# EasyEDA Pro project ProPrj_TC375_2025-11-27.epro, board PCB2
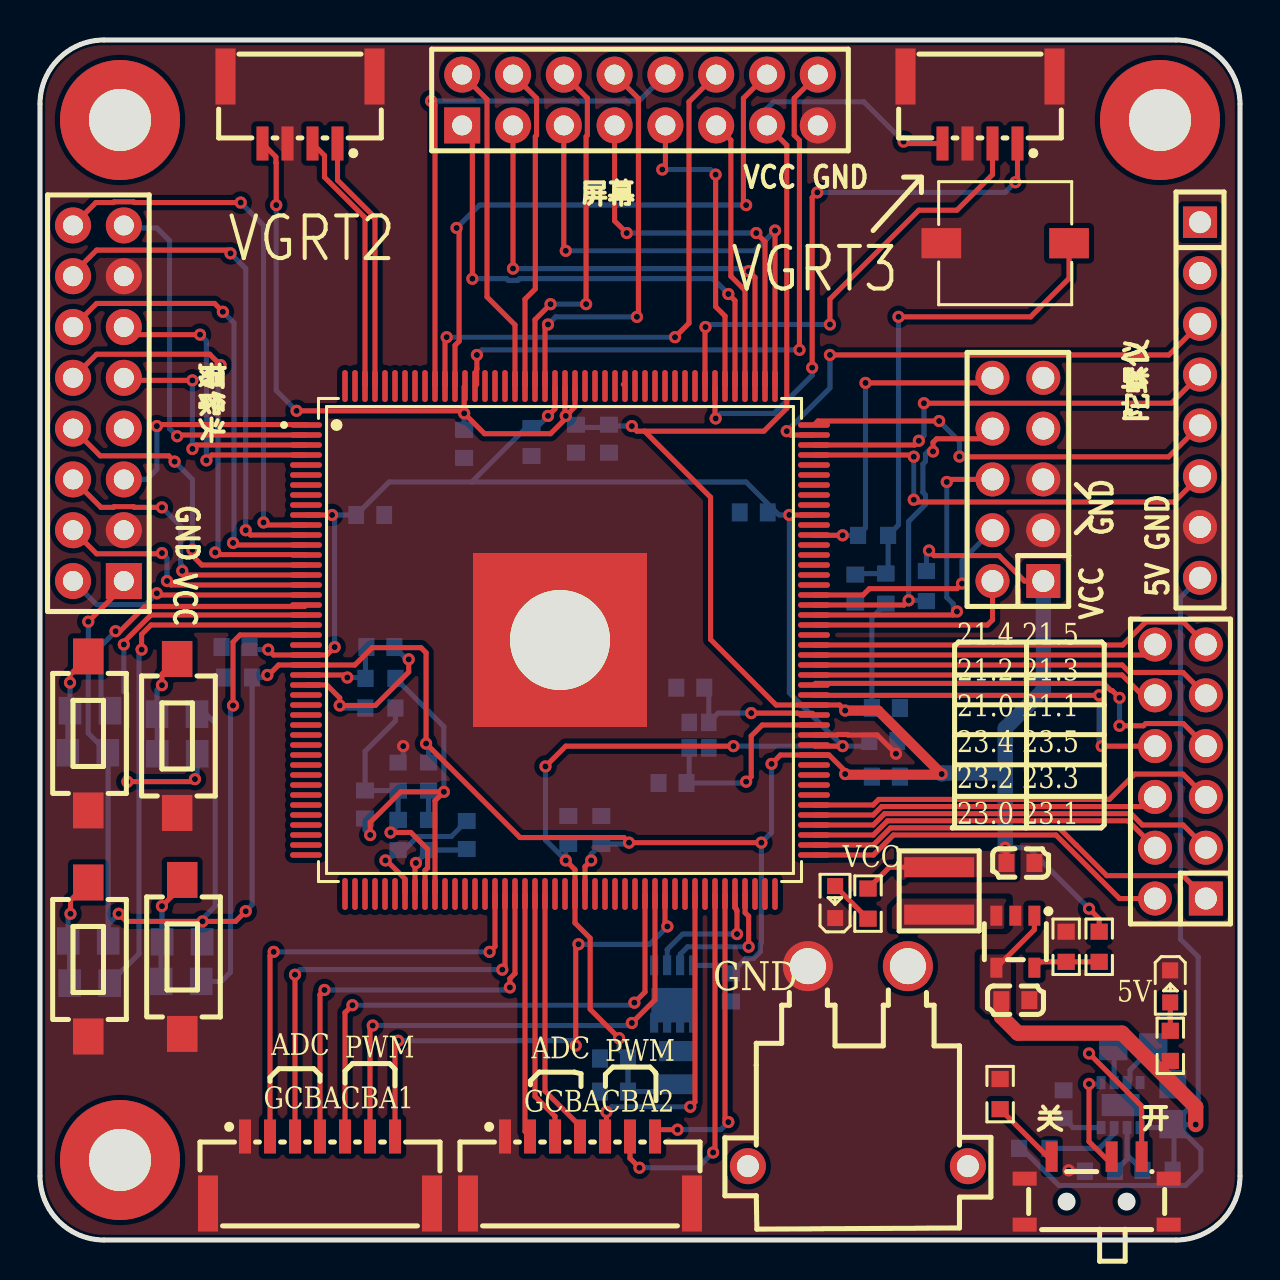
[diagram p4: board, top side]
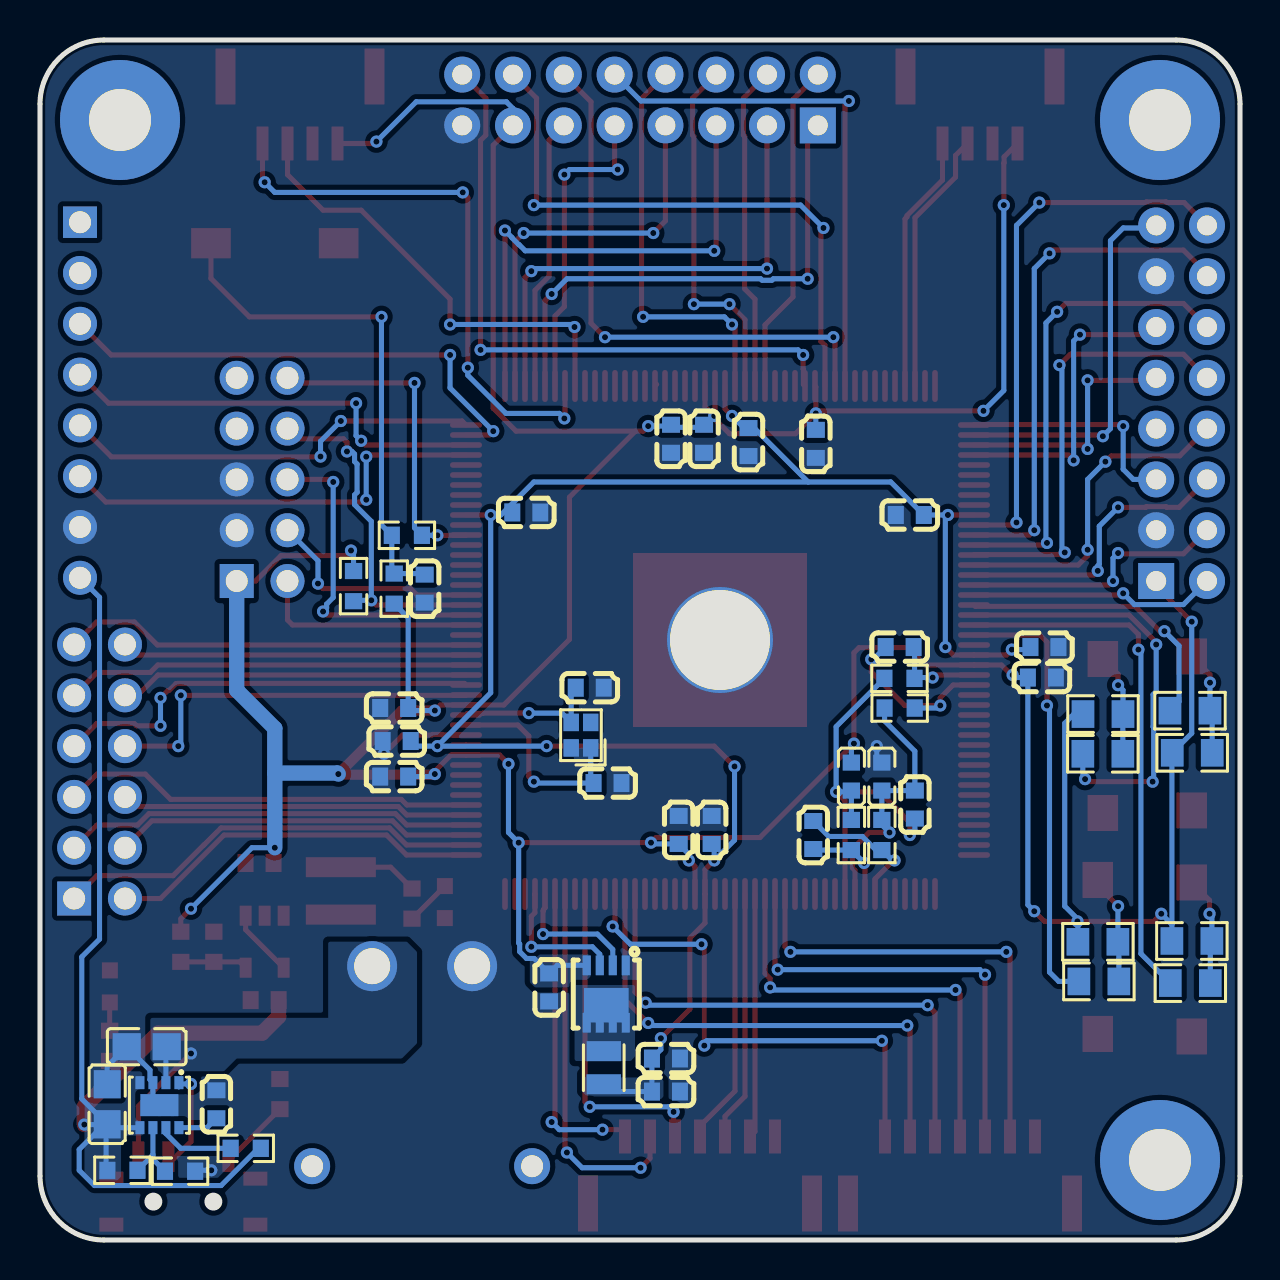
[diagram p5: board, bottom side, seen from below]

Outline 60 x 60 mm; copper layers: Top Layer, Bottom Layer. Coordinates in mm from the lower left corner of the outline.
Outline path: 0,56.8 0,3.2 arc(0.94,0.94) 3.2,0 56.8,0 arc(59.06,0.94) 60,3.2 60,56.8 arc(59.06,59.06) 56.8,60 3.2,60 arc(0.94,59.06) 0,56.8
Stack: Top Layer 0.035mm / Dielectric1 1.51mm FR4 er 4.5 / Bottom Layer 0.035mm

## Design rules (mm)
template: 自定义配置
spacing copperThickness1oz (default): track to track 0.102, other pairs 0.152 to 0.3
spacing copperThickness2oz: track to track 0.203, other pairs 0.152 to 0.3
track width copperThickness1oz (default): min 0.127, default 0.254, max 2.54
track width copperThickness2oz: min 0.203, default 0.254, max 2.54
differential pair differentialPair (default): width min 0.127, default 0.254, max 2.54; gap min 0.152, default 0.152
via viaSize (default): diameter min 0.5, default 0.61, max 10; hole min 0.3, default 0.305, max 6.3

## Placement (name value [footprint] x y rotation side)
C1  100nF  [C0603]  16.51 36.25 180 bottom
C2  100nF  [C0603]  9.78 29.65 0 bottom
C3  100nF  [C0603]  9.91 28.12 0 bottom
C4  100nF  [C0603]  28.07 20.5 270 bottom
C5  22uF  [C0603]  34.54 12.63 270 bottom
C6  10uF  [C0603]  28.7 7.42 0 bottom
C7  22uF  [C0603]  28.7 9.07 0 bottom
C8  100nF  [C0603]  21.21 39.81 90 bottom
C9  100nF  [C0603]  24.57 39.9 90 bottom
C10  100nF  [C0603]  28.45 40.06 90 bottom
C11  100nF  [C0603]  26.8 40.06 90 bottom
C12  100nF  [C0603]  26.42 20.5 270 bottom
C13  100nF  [C0603]  35.69 36.38 0 bottom
C14  100nF  [C0603]  42.29 26.6 180 bottom
C15  100nF  [C0603]  42.16 24.95 180 bottom
C16  100nF  [C0603]  42.29 23.17 180 bottom
C17  100nF  [C0603]  16.26 21.77 90 bottom
C18  100nF  [C0603]  21.34 20.25 90 bottom
C19  100nF  [C0603]  17.02 29.65 0 bottom
C20  100nF  [C0603]  40.77 32.57 90 bottom
C21  100nF  [C0603]  31.62 22.85 180 bottom
C22  100nF  [C0603]  32.51 27.61 0 bottom
C111  10uF  [C0603]  49.02 18.85 180 top
C112  4.7uF  [C0603]  48.77 11.99 180 top
C113  10uF  [C0805]  54.67 9.66 180 bottom
C114  3.3nF  [C0603]  51.18 6.79 270 bottom
C115  22uF  [C0805]  56.64 6.79 90 bottom
CN1  WAFER-GH1.25-7PLB  [CONN-SMD_7P-P1.25_XUNPU_WAFER-GH1.25-7PLB]  14 3.5 0 top
CN2  WAFER-GH1.25-7PLB  [CONN-SMD_7P-P1.25_XUNPU_WAFER-GH1.25-7PLB]  27 3.5 0 top
CN32  XT30PW-M30.G.Y  [CONN-TH_XT30PW-M]  40.89 8.69 0 top
H1  PZ254V-12-10P  [HDR-TH_10P-P2.54-V-M-R2-C5-S2.54]  48.9 38.03 90 top
H6  PZ254V-12-12P  [HDR-TH_12P-P2.54-V-M-R2-C6-S2.54]  57.02 23.42 90 top
J1  2.54-2*8P母  [HDR-TH_16P-P2.54-V-F-R2-C8-S2.54]  30 57 0 top
J2  2.54-2*8P母  [HDR-TH_16P-P2.54-V-F-R2-C8-S2.54]  2.92 41.84 90 top
L1  0R  [L0603]  19.43 23.17 270 bottom
L2  0R  [L0603]  17.91 23.17 270 bottom
L12  XFL4020-222MEC  [IND-SMD_L4.0-W4.0_XAL4030-332MEC]  44.96 17.45 270 top
LED12  -  [LED_0603]  39.75 16.95 90 top
LED13  -  [LED_0603]  56.51 12.63 270 top
NOREF  -  [Pad_e924]  26 30 0 top
Q2  BSZ15DC02KDHXTMA1  [POWERPAK-1212-8_L3.3-W3.3-P0.65-BL-EP]  31.69 12.3 0 bottom
R1  0R  [R0603]  17.03 28.08 0 bottom
R2  0R  [R0603]  17.02 26.6 0 bottom
R3  0R  [R0603]  17.91 20.25 270 bottom
R4  0R  [R0603]  19.43 20.25 270 bottom
R5  10K  [R0603]  44.32 32.69 90 bottom
R6  680R  [R0603]  41.66 35.23 0 bottom
R13  10K  [R0603]  42.29 32.57 270 bottom
R41  5kΩ  [R0805]  2.39 24.36 180 bottom
R42  5kΩ  [R0805]  6.85 26.3 180 bottom
R43  5kΩ  [R0805]  2.41 14.95 180 bottom
R44  5kΩ  [R0805]  7.1 14.91 180 bottom
R45  470Ω  [R0805]  2.5 26.47 0 bottom
R46  470Ω  [R0805]  6.86 24.31 0 bottom
R47  470Ω  [R0805]  2.48 12.84 0 bottom
R48  470Ω  [R0805]  7.06 12.93 0 bottom
R82  10K  [R0603]  52.96 14.66 90 top
R83  2.21K  [R0603]  51.31 14.66 270 top
R84  10K  [R0603]  41.4 16.82 90 top
R102  100K  [R0603]  49.71 4.58 0 bottom
R103  53K  [R0603]  55.88 3.49 180 bottom
R104  10K  [R0603]  53 3.44 0 bottom
R105  10K  [R0603]  56.51 9.71 270 top
R106  10K  [R0603]  48.01 7.29 270 top
SW1  TS3625A  [KEY-SMD_L6.0-W3.5-LS8.4]  2.41 25.33 270 top
SW2  TS3625A  [KEY-SMD_L6.0-W3.5-LS8.4]  6.86 25.2 270 top
SW3  TS3625A  [KEY-SMD_L6.0-W3.5-LS8.4]  2.41 14.03 270 top
SW4  TS3625A  [KEY-SMD_L6.0-W3.5-LS8.4]  7.11 14.15 270 top
SW5  MSK12C02-SZ  [SW-TH_MSK12C02]  52.83 2.47 0 top
U2  TC375TP96F300WAAKXUMA1  [PG-LQFP-176_L24.0-W24.0-P0.50-LS26.0-BL-EP8.7]  26 30 270 top
U25  M3安装孔  [洞3MM]  4 4 0 top
U29  PM254-1-08-Z-8.5  [HDR-TH_8P-P2.54-V-F]  58 42 270 top
U42  TS665WS 250gf  [SW-SMD_L6.0-W6.0-LS6.6]  48.26 49.84 180 top
U44  TPS82130SILR  [USIP-8_L3.0-W2.8-P0.65-TL-EP]  54.03 6.74 270 bottom
U47  M3安装孔  [洞3MM]  56 56 0 top
U48  M3安装孔  [洞3MM]  4 56 0 top
U49  3.3uH  [IND-SMD_L2.0-W1.6]  31.81 8.62 270 bottom
U59  TLV62569DBVR  [SOT-23-5_L3.0-W1.7-P0.95-LS2.8-BR]  48.77 14.92 90 top
U64  WAFER-GH1.25-4PLB  [CONN-SMD_4P-P1.25_XUNPU_WAFER-GH1.25-4PLB]  13 56.5 180 top
U65  WAFER-GH1.25-4PLB  [CONN-SMD_4P-P1.25_XUNPU_WAFER-GH1.25-4PLB]  47 56.5 180 top
X1  24MHz  [CRYSTAL-SMD_4P-L2.0-W1.6-BL-A]  32.95 25.24 90 bottom

## Footprints (pads in the part's own frame, mm; a bottom-side part is the same pattern mirrored in y, then rotated)
C0603
  rect 0.8x0.9 smd: 1(-0.7,0) 2(0.7,0)
C0805
  rect 1.41x1.35 smd: 1(-1,0) 2(1,0)
CONN-SMD_4P-P1.25_XUNPU_WAFER-GH1.25-4PLB
  rect 0.6x1.7 smd: 1(-1.875,1.675) 2(-0.625,1.675) 3(0.625,1.675) 4(1.875,1.675)
  rect 1x2.8 smd: 5(-3.725,-1.675) 6(3.725,-1.675)
CONN-SMD_7P-P1.25_XUNPU_WAFER-GH1.25-7PLB
  rect 0.6x1.7 smd: 1(-3.75,1.675) 2(-2.499,1.675) 3(-1.25,1.675) 4(0,1.675) 5(1.25,1.675) 6(2.5,1.675) 7(3.75,1.675)
  rect 1x2.8 smd: 8(5.6,-1.675) 9(-5.6,-1.675)
CONN-TH_XT30PW-M
  round 2.5 hole 1.8: 1(-2.5,5) 2(2.5,5)
  round 1.8 hole 1.1: 3(5.5,-5) 4(-5.5,-5)
CRYSTAL-SMD_4P-L2.0-W1.6-BL-A
  rect 0.875x0.775 smd: 1(-0.638,-0.488) 2(0.638,-0.488) 3(0.638,0.488) 4(-0.638,0.488)
HDR-TH_8P-P2.54-V-F
  rect 1.575x1.7 hole 1.1: 1(-8.89,0)
  round 1.7 hole 1.1: 2(-6.35,0) 3(-3.81,0) 4(-1.27,0) 5(1.27,0) 6(3.81,0) 7(6.35,0) 8(8.89,0)
HDR-TH_10P-P2.54-V-M-R2-C5-S2.54
  rect 1.7x1.7 hole 1.1: 1(-5.08,-1.27)
  round 1.7 hole 1.1: 2(-5.08,1.27) 3(-2.54,-1.27) 4(-2.54,1.27) 5(0,-1.27) 6(0,1.27) 7(2.54,-1.27) 8(2.54,1.27) 9(5.08,-1.27) 10(5.08,1.27)
HDR-TH_12P-P2.54-V-M-R2-C6-S2.54
  rect 1.7x1.7 hole 1.1: 1(-6.35,-1.27)
  round 1.7 hole 1.1: 2(-6.35,1.27) 3(-3.81,-1.27) 4(-3.81,1.27) 5(-1.27,-1.27) 6(-1.27,1.27) 7(1.27,-1.27) 8(1.27,1.27) 9(3.81,-1.27) 10(3.81,1.27) 11(6.35,-1.27) 12(6.35,1.27)
HDR-TH_16P-P2.54-V-F-R2-C8-S2.54
  rect 1.8x1.8 hole 1: 1(-8.89,-1.27)
  round 1.8 hole 1: 2(-8.89,1.27) 3(-6.35,-1.27) 4(-6.35,1.27) 5(-3.81,-1.27) 6(-3.81,1.27) 7(-1.27,-1.27) 8(-1.27,1.27) 9(1.27,-1.27) 10(1.27,1.27) 11(3.81,-1.27) 12(3.81,1.27) 13(6.35,-1.27) 14(6.35,1.27) 15(8.89,-1.27) 16(8.89,1.27)
IND-SMD_L2.0-W1.6
  rect 1x1.72 smd: 1(0.828,0) 2(-0.828,0)
IND-SMD_L4.0-W4.0_XAL4030-332MEC
  rect 1x3.5 smd: 1(-1.185,0) 2(1.185,0)
KEY-SMD_L6.0-W3.5-LS8.4
  rect 1.8x1.524 smd: 1(-3.85,0) 2(3.85,0)
L0603
  rect 0.8x0.864 smd: 1(-0.7,0) 2(0.7,0)
LED_0603
  rect 0.8x0.8 smd: 1(-0.851,-0.01) 2(0.75,-0.005)
Pad_e924
  round 5.3 hole 5: 1(0,0)
PG-LQFP-176_L24.0-W24.0-P0.50-LS26.0-BL-EP8.7
  oval 0.28x1.6 smd: 1(-10.75,-12.7) 2(-10.25,-12.7) 3(-9.75,-12.7) 4(-9.25,-12.7) 5(-8.75,-12.7) 6(-8.25,-12.7) 7(-7.75,-12.7) 8(-7.25,-12.7) 9(-6.75,-12.7) 10(-6.25,-12.7) 11(-5.75,-12.7) 12(-5.25,-12.7) 13(-4.75,-12.7) 14(-4.25,-12.7) 15(-3.75,-12.7) 16(-3.25,-12.7) 17(-2.75,-12.7) 18(-2.25,-12.7) 19(-1.75,-12.7) 20(-1.25,-12.7) 21(-0.75,-12.7) 22(-0.25,-12.7) 23(0.25,-12.7) 24(0.75,-12.7) 25(1.25,-12.7) 26(1.75,-12.7) 27(2.25,-12.7) 28(2.75,-12.7) 29(3.25,-12.7) 30(3.75,-12.7) 31(4.25,-12.7) 32(4.75,-12.7) 33(5.25,-12.7) 34(5.75,-12.7) 35(6.25,-12.7) 36(6.75,-12.7) 37(7.25,-12.7) 38(7.75,-12.7) 39(8.25,-12.7) 40(8.75,-12.7) 41(9.25,-12.7) 42(9.75,-12.7) 43(10.25,-12.7) 44(10.75,-12.7) 89(10.75,12.7) 90(10.25,12.7) 91(9.75,12.7) 92(9.25,12.7) 93(8.75,12.7) 94(8.25,12.7) 95(7.75,12.7) 96(7.25,12.7) 97(6.75,12.7) 98(6.25,12.7) 99(5.75,12.7) 100(5.25,12.7) 101(4.75,12.7) 102(4.25,12.7) 103(3.75,12.7) 104(3.25,12.7) 105(2.75,12.7) 106(2.25,12.7) 107(1.75,12.7) 108(1.25,12.7) 109(0.75,12.7) 110(0.25,12.7) 111(-0.25,12.7) 112(-0.75,12.7) 113(-1.25,12.7) 114(-1.75,12.7) 115(-2.25,12.7) 116(-2.75,12.7) 117(-3.25,12.7) 118(-3.75,12.7) 119(-4.25,12.7) 120(-4.75,12.7) 121(-5.25,12.7) 122(-5.75,12.7) 123(-6.25,12.7) 124(-6.75,12.7) 125(-7.25,12.7) 126(-7.75,12.7) 127(-8.25,12.7) 128(-8.75,12.7) 129(-9.25,12.7) 130(-9.75,12.7) 131(-10.25,12.7) 132(-10.75,12.7)
  oval 1.6x0.28 smd: 45(12.7,-10.75) 46(12.7,-10.25) 47(12.7,-9.75) 48(12.7,-9.25) 49(12.7,-8.75) 50(12.7,-8.25) 51(12.7,-7.75) 52(12.7,-7.25) 53(12.7,-6.75) 54(12.7,-6.25) 55(12.7,-5.75) 56(12.7,-5.25) 57(12.7,-4.75) 58(12.7,-4.25) 59(12.7,-3.75) 60(12.7,-3.25) 61(12.7,-2.75) 62(12.7,-2.25) 63(12.7,-1.75) 64(12.7,-1.25) 65(12.7,-0.75) 66(12.7,-0.25) 67(12.7,0.25) 68(12.7,0.75) 69(12.7,1.25) 70(12.7,1.75) 71(12.7,2.25) 72(12.7,2.75) 73(12.7,3.25) 74(12.7,3.75) 75(12.7,4.25) 76(12.7,4.75) 77(12.7,5.25) 78(12.7,5.75) 79(12.7,6.25) 80(12.7,6.75) 81(12.7,7.25) 82(12.7,7.75) 83(12.7,8.25) 84(12.7,8.75) 85(12.7,9.25) 86(12.7,9.75) 87(12.7,10.25) 88(12.7,10.75) 133(-12.7,10.75) 134(-12.7,10.25) 135(-12.7,9.75) 136(-12.7,9.25) 137(-12.7,8.75) 138(-12.7,8.25) 139(-12.7,7.75) 140(-12.7,7.25) 141(-12.7,6.75) 142(-12.7,6.25) 143(-12.7,5.75) 144(-12.7,5.25) 145(-12.7,4.75) 146(-12.7,4.25) 147(-12.7,3.75) 148(-12.7,3.25) 149(-12.7,2.75) 150(-12.7,2.25) 151(-12.7,1.75) 152(-12.7,1.25) 153(-12.7,0.75) 154(-12.7,0.25) 155(-12.7,-0.25) 156(-12.7,-0.75) 157(-12.7,-1.25) 158(-12.7,-1.75) 159(-12.7,-2.25) 160(-12.7,-2.75) 161(-12.7,-3.25) 162(-12.7,-3.75) 163(-12.7,-4.25) 164(-12.7,-4.75) 165(-12.7,-5.25) 166(-12.7,-5.75) 167(-12.7,-6.25) 168(-12.7,-6.75) 169(-12.7,-7.25) 170(-12.7,-7.75) 171(-12.7,-8.25) 172(-12.7,-8.75) 173(-12.7,-9.25) 174(-12.7,-9.75) 175(-12.7,-10.25) 176(-12.7,-10.75)
  rect 8.7x8.7 smd: 177(0,0)
POWERPAK-1212-8_L3.3-W3.3-P0.65-BL-EP
  rect 0.405x0.99 smd: 1(-0.975,-1.435) 2(-0.325,-1.435) 3(0.325,-1.435) 4(0.975,-1.435) 5(0.975,1.435) 6(0.325,1.435) 7(-0.325,1.435) 8(-0.975,1.435)
  rect 2.235x1.725 smd: 9(0,0.557)
R0603
  rect 0.806x0.864 smd: 1(-0.753,0) 2(0.753,0)
R0805
  rect 1.133x1.377 smd: 1(-1,0) 2(1,0)
SOT-23-5_L3.0-W1.7-P0.95-LS2.8-BR
  rect 1x0.6 smd: 1(1.3,-0.95) 2(1.3,0) 3(1.3,0.95) 4(-1.3,0.95) 5(-1.3,-0.95)
SW-SMD_L6.0-W6.0-LS6.6
  rect 1.985x1.512 smd: 1(-3.192,0) 2(3.192,0)
SW-TH_MSK12C02
  rect 0.6x1.524 smd: 1(-2.25,1.7) 2(0.75,1.7) 3(2.25,1.7)
  rect 1.2x0.7 smd: 4(-3.6,0.6) 4(-3.6,-1.7) 4(3.6,0.6) 4(3.6,-1.7)
USIP-8_L3.0-W2.8-P0.65-TL-EP
  rect 0.65x0.45 smd: 1(-1.125,0.975) 2(-1.125,0.325) 3(-1.125,-0.325) 4(-1.125,-0.975) 5(1.125,-0.975) 6(1.125,-0.325) 7(1.125,0.325) 8(1.125,0.975)
  rect 1.1x1.9 smd: 9(0,0)
洞3MM
  round 6 hole 3.1: 1(0,0)

## Nets
As in the schematic, except:
GND: C1.1 C2.1 C3.1 C4.1 C5.2 C6.1 C7.1 C8.1 C9.1 C10.1 C11.1 C12.1 C13.1 C14.1 C15.1 C16.1 C20.1 C21.2 C22.1 C111.1 C112.1 C113.1 C114.1 C115.2 CN1.1 CN1.8 CN1.9 CN2.1 CN2.8 CN2.9 CN32.1 H1.3 H1.5 J1.15 J2.3 J2.13 L2.1 LED12.1 LED13.1 NOREF.1 Q2.1 R83.1 R104.1 R106.1 SW1.2 SW2.2 SW3.2 SW4.2 SW5.4 U2.101 U2.177 U29.7 U42.2 U44.3 U44.9 U59.2 U64.3 U64.5 U64.6 U65.3 U65.5 U65.6

Pads without a net: CN32 3 4; H1 7 9; J2 7; U2 9; U25 1; U29 1 2; U47 1; U48 1; X1 2 4

## Via types
v1: diameter 0.61, hole 0.305, Top Layer to Bottom Layer, 148 vias

## Routing (per net, layer and track width the routed paths; a pad name or vN(x,y) marks a point on that pad's centre or on a via; arc(x,y) is an arc through that point)
+5V: length 63.7
  Top Layer w0.254: U59.1 49.72,15.52 U59.4
  Top Layer w0.762: C112.2 48.07,11.17 48.9,10.34 54.1,10.34 57.78,6.66 v1(57.78,5.77)
  Bottom Layer w0.254: R103.1 56.63,3.61 56.7,3.68 56.7,5.77 ; 56.71,5.86 57.91,7.06 57.91,14.15 57.02,15.04 57.02,32.13 U29.8 ; 56.71,5.86 56.7,5.84 ; 56.71,5.86 56.8,5.77 ; 56.71,5.86 56.7,5.87 56.7,5.84 ; 56.7,5.84 C115.1 ; 56.7,5.84 56.7,5.77 ; 56.8,5.77 56.7,5.77 ; 56.8,5.77 58.04,4.53 58.04,3.49 57.28,2.72 50.95,2.72 49.09,4.58 R102.1 ; 56.8,5.77 v1(57.78,5.77) ; 56.7,5.77 56.66,5.77 ; 55.01,5.62 56.57,5.62 56.69,5.74
GND: length 12.8
  Top Layer w0.254: U2.101 39.86,25.25 39.89,25.28 40.37,25.28 40.4,25.25 41.86,25.25 v1(42.8,24.31)
  Bottom Layer w0.254: C115.2 56.64,8.69 C113.1 54.5,8.5 54.5,8.01 U44.3 54.36,7.07 U44.9 ; v1(42.8,24.31) 42.86,24.38 C15.1 ; v1(51.44,3.49) 52.2,3.49 R104.1 ; v1(18.16,24.69) 18.16,24.12 L2.1
VCC1V25: length 96.9
  Top Layer w0.254: v1(25.27,23.68) 26.29,24.69 34.54,24.69 ; U2.155 25.75,41.55 v1(25.4,41.2) ; U2.100 38.76,24.69 v1(40.13,24.69) ; v1(26.29,18.98) 26.75,18.52 U2.68 26.75,15.85 27.51,15.09 27.51,11.54 v1(28.96,10.09) ; v1(14.6,36.25) 13.3,36.25 ; v1(11.41,29.52) 11.68,29.25 U2.24 14.34,29.25 v1(14.73,29.65) ; 38.7,36.25 v1(37.47,36.25)
  Bottom Layer w0.254: C15.2 41.21,24.69 v1(40.13,24.69) ; v1(25.4,41.2) 24.79,40.6 C9.2 24.28,40.6 21.59,37.9 ; 10.48,29.65 10.61,29.52 v1(11.41,29.52) ; v1(25.27,23.68) 25.27,20 v1(26.29,18.98) 26.29,19.68 C12.2 ; 21.59,37.9 17.46,37.9 C1.2 v1(14.6,36.25) 14.73,36.12 v1(14.73,29.65) ; 21.59,37.9 35.31,37.9 36.96,36.25 v1(37.47,36.25) 37.47,27.36 v1(40.13,24.69) ; v1(34.67,24.69) v1(40.13,24.69) ; v1(28.96,10.09) 28.96,9.52 C7.2 C6.2 31.45,7.42 U49.1
VCC3V3: length 253.4
  Top Layer w0.254: J1.13 37.34,54.74 37.34,41.58 36.19,40.44 30.23,40.44 ; v1(3.94,16.31) 4.32,15.93 v1(8.13,15.93) 9.78,15.93 v1(10.29,16.44) ; U65.4 43.28,54.83 v1(43.18,54.92) ; C111.2 48.32,19.55 v1(48.26,19.61) ; U2.164 21.21,42.66 v1(21.21,41.33) ; v1(26.29,41.2) 26.75,41.67 U2.153 ; v1(26.29,41.2) 26.25,41.24 U2.154 ; v1(26.29,41.2) 26.29,41.08 25.53,40.31 22.22,40.31 v1(21.21,41.33) ; U2.69 27.25,18.67 v1(27.56,18.98) ; 30.23,40.44 29.84,40.44 v1(29.59,40.7) ; 30.23,40.44 33.53,37.14 33.53,30.03 36.81,26.75 U2.104 39.98,26.75 v1(40.26,26.47) ; v1(11.81,51.75) 11.81,53.84 11.8,53.86 11.8,54.15 U64.4 ; v1(40.26,23.3) 40.26,23.44 39.45,24.25 U2.99 37.02,24.25 v1(36.58,23.81) ; v1(52.45,16.57) 52.96,16.06 R82.2 ; L12.1 42.47,18.64 R84.2 ; 50.16,32.95 49.22,32.95 47.95,34.22 44.7,34.22 v1(44.45,34.47) ; v1(12.83,41.46) 21.08,41.46 v1(21.21,41.33) ; J2.1 4.19,32.69 v1(2.41,30.92) ; v1(11.37,28.25) 11.43,28.25 11.93,28.75 U2.25 15.74,28.75 16.61,29.62 19.05,29.62 19.3,29.36 v1(19.3,24.82) 24,20.12 29.2,20.12 v1(29.45,19.87) v1(36.07,19.87)
  Top Layer w0.508: v1(40.26,26.47) 41.91,26.47 v1(45.09,23.3) 45.05,23.26 40.29,23.26 v1(40.26,23.3)
  Bottom Layer w0.254: L1.1 19.43,24.69 v1(19.3,24.82) ; 3.41,15.78 v1(3.94,16.31) ; 3.41,15.78 R43.1 ; 3.41,15.78 3.41,24.34 R41.1 2.41,25.34 v1(2.41,30.92) ; 26.88,40.6 26.76,40.72 ; v1(10.29,16.44) 10.61,16.76 C3.2 11.24,28.12 v1(11.37,28.25) ; Q2.4 34.14,13.73 34.54,13.33 35.29,14.08 35.68,14.08 36.02,14.42 36.02,14.8 36.07,14.85 v1(36.07,19.87) 36.58,20.38 v1(36.58,23.81) ; v1(27.56,18.98) 27.56,19.3 C4.2 ; v1(29.59,40.7) 28.51,40.7 28.45,40.76 ; v1(48.26,19.61) 49.4,19.61 v1(52.45,16.57) ; C16.2 40.39,23.17 v1(40.26,23.3) ; R42.1 8.3,26.3 8.76,25.84 8.76,16.69 8.1,16.03 R44.1 ; J1.13 36.35,56.58 36.68,56.91 41.19,56.91 v1(43.18,54.92) ; 28.07,19.87 28.13,19.8 29.45,19.8 ; v1(11.81,51.75) 11.81,42.47 v1(12.83,41.46) ; 28.45,40.63 26.92,40.63 26.35,41.2 v1(26.29,41.2) ; R5.2 44.32,34.35 v1(44.45,34.47) ; C8.2 v1(21.21,41.33) ; v1(40.26,26.47) 41.46,26.47 C14.2 41.59,31.11 R13.2
  Bottom Layer w0.762: 48.26,23.35 45.14,23.35 v1(45.09,23.3) ; 48.26,23.35 48.26,25.58 50.16,27.49 50.16,32.95 ; 48.26,23.35 v1(48.26,19.61)
VDDM: length 20.1
  Top Layer w0.254: v1(16.51,20.25) 16.51,20.88 18.03,22.41 v1(20.19,22.41) 19.75,21.97 U2.54
  Bottom Layer w0.254: C17.1 16.26,20.5 v1(16.51,20.25) ; R1.2 20.19,25.67 v1(20.19,22.41) 19.49,22.41 L1.2 R4.1
VIN: length 8.4
  Top Layer w0.254: 55.08,3.79 55.08,6.7 v1(52.45,9.33)
  Bottom Layer w0.254: U44.2 53.71,9.62 C113.2
VSSM: length 13.2
  Top Layer w0.254: U2.53 19.25,18.48 19.38,18.61 19.38,19.54 18.54,20.38 v1(17.53,20.38)
  Bottom Layer w0.254: R2.2 17.77,25.96 16.26,24.44 C17.2 16.26,22.47 L2.2 R3.1 17.91,20.76 v1(17.53,20.38)
AN2: length 12.8
  Top Layer w0.254: U2.65 25.25,7.44 27,5.69 CN2.4
AN3: length 12.5
  Top Layer w0.254: U2.64 24.75,7.18 25.75,6.18 CN2.3
AN4: length 12.2
  Top Layer w0.254: CN2.2 24.25,5.43 U2.63
AN5: length 21.5
  Top Layer w0.254: 23.75,17.3 23.75,13.33 23.5,13.07 v1(23.5,12.63) ; v1(14.22,12.5) 14,12.28 CN1.4
  Bottom Layer w0.254: v1(14.22,12.5) 23.37,12.5 v1(23.5,12.63)
AN6: length 22.4
  Top Layer w0.254: U2.61 23.25,13.65 v1(23.11,13.52) ; CN1.3 v1(12.75,13.26)
  Bottom Layer w0.254: v1(12.75,13.26) 13,13.52 v1(23.11,13.52)
AN7: length 23.1
  Top Layer w0.254: v1(22.48,14.41) 22.75,14.68 U2.60 ; v1(11.68,14.41) 11.5,14.22 CN1.2
  Bottom Layer w0.254: v1(11.68,14.41) v1(22.48,14.41)
MT9V03_RXD: length 12.7
  Top Layer w0.254: v1(7.62,42.98) 4.32,42.98 J2.9 ; U2.3 7.82,39.75 v1(7.62,39.55)
  Bottom Layer w0.254: v1(7.62,39.55) v1(7.62,42.98)
MT9V03_TXD: length 15.5
  Top Layer w0.254: v1(8.32,38.98) 8.59,39.25 U2.4 ; J2.11 4.57,45.27 v1(8,45.27)
  Bottom Layer w0.254: v1(8.32,38.98) 8.32,44.95 v1(8,45.27)
P00.0: length 27.5
  Top Layer w0.254: J2.16 2.79,51.87 3.67,51.87 3.7,51.91 4.68,51.91 4.72,51.87 v1(10.03,51.87) ; U2.11 11.3,35.75 v1(11.18,35.88)
  Bottom Layer w0.254: v1(10.03,51.87) 11.18,50.73 v1(11.18,35.88)
P00.1: length 25.8
  Top Layer w0.254: v1(10.29,35.49) 10.53,35.25 U2.12 ; v1(9.53,49.33) 9.36,49.5 2.83,49.5 1.65,48.32 J2.14
  Bottom Layer w0.254: v1(10.29,35.49) 10.29,48.57 v1(9.53,49.33)
P00.2: length 23.7
  Top Layer w0.254: U2.13 9.76,34.75 v1(9.65,34.85) ; J2.12 2.83,46.83 8.73,46.83 v1(9.14,46.41)
  Bottom Layer w0.254: v1(9.65,34.85) 9.7,34.91 9.7,45.85 v1(9.14,46.41)
P00.3: length 22.2
  Top Layer w0.254: U2.14 13.28,34.27 8.87,34.27 v1(8.76,34.38) ; J2.10 2.83,44.29 8.49,44.29 v1(9.03,43.74)
  Bottom Layer w0.254: v1(8.76,34.38) 8.9,34.52 8.9,43.62 v1(9.03,43.74)
P00.4: length 16.7
  Top Layer w0.254: U2.15 8.09,33.75 7.62,34.22 v1(7.62,34.51) ; J2.8 3.01,39.21 6.44,39.21 v1(6.73,38.92)
  Bottom Layer w0.254: v1(6.73,38.92) 7.62,38.03 v1(7.62,34.51)
P00.5: length 14.9
  Top Layer w0.254: v1(7.11,33.46) 7.32,33.25 U2.16 ; J2.6 3.05,36.63 3.67,36.63 3.7,36.67 4.68,36.67 4.72,36.63 v1(6.1,36.63)
  Bottom Layer w0.254: v1(7.11,33.46) 7.11,33.71 7.04,33.79 7.04,35.69 v1(6.1,36.63)
P00.6: length 13.5
  Top Layer w0.254: J2.4 2.83,34.31 6.06,34.31 v1(6.1,34.35) ; v1(6.35,32.95) 6.55,32.75 U2.17
  Bottom Layer w0.254: v1(6.35,32.95) 6.35,34.09 v1(6.1,34.35)
P00.7: length 12.4
  Top Layer w0.254: v1(5.84,32.33) 5.93,32.25 U2.18
  Bottom Layer w0.254: v1(5.84,32.33) 5.28,31.77 2.83,31.77 J2.2
P00.8: length 14.5
  Top Layer w0.254: v1(3.78,30.44) 4,30.44 5.24,31.68 13.23,31.68 U2.19
  Bottom Layer w0.254: v1(3.78,30.44) 3.05,29.71 3.05,26.92 R45.2
P00.9: length 21.5
  Top Layer w0.254: U2.20 5.54,31.25 4.19,29.9 v1(4.19,29.77) ; v1(7.75,23.04) 7.62,22.92 v1(4.37,22.92)
  Bottom Layer w0.254: v1(4.19,29.77) 4.19,27.43 4.35,27.27 4.35,25.66 4.32,25.64 4.32,22.97 v1(4.37,22.92) ; R46.2 7.86,23.15 v1(7.75,23.04)
P00.10: length 26.5
  Top Layer w0.254: U2.21 5.55,30.75 5.08,30.28 v1(5.08,29.52)
  Bottom Layer w0.254: R47.2 4.95,14.31 4.95,29.39 v1(5.08,29.52)
P00.11: length 22
  Top Layer w0.254: v1(9.65,26.73) 9.65,29.9 10,30.25 U2.22
  Bottom Layer w0.254: R48.2 9.06,12.93 9.53,13.39 9.53,26.6 v1(9.65,26.73)
P02.0: length 11.5
  Top Layer w0.254: U2.1 13.28,40.77 5.92,40.77 v1(5.84,40.7)
  Bottom Layer w0.254: v1(5.84,40.7) 5.84,38.54 5.33,38.03 J2.5
P02.1: length 19
  Top Layer w0.254: U2.2 6.92,40.25 v1(6.86,40.19)
  Bottom Layer w0.254: v1(6.86,40.19) 6.48,40.57 6.48,49.97 5.84,50.6 4.19,50.6
P10.5: length 12.9
  Top Layer w0.254: U64.1 14.88,52.99 16.65,51.22 16.65,51.15 16.75,51.05 U2.173
P10.6: length 13.2
  Top Layer w0.254: U2.174 16.25,51.12 14.22,53.14 14.22,54.23 U64.2
P11.9: length 32.2
  Top Layer w0.254: v1(21.84,44.25) 21.84,43.55 21.83,43.53 21.83,42.78 U2.163 ; J1.16 37.71,57.09 37.71,55.24 37.97,54.98 v1(37.97,44.51)
  Bottom Layer w0.254: v1(37.97,44.51) 22.1,44.51 v1(21.84,44.25)
P11.10: length 30.1
  Top Layer w0.254: J1.14 35.17,57.09 35.17,51.88 v1(35.31,51.75) ; U2.165 20.75,44.73 20.96,44.94 20.96,50.47 v1(20.83,50.6)
  Bottom Layer w0.254: v1(35.31,51.75) 21.97,51.75 v1(20.83,50.6)
P11.11: length 27.9
  Top Layer w0.254: J1.12 32.45,56.91 32.45,45.84 v1(31.75,45.14) ; U2.166 20.25,45.06 v1(20.33,45.14)
  Bottom Layer w0.254: v1(31.75,45.14) v1(20.33,45.14)
P11.12: length 26.6
  Top Layer w0.254: v1(19.56,56.95) 19.75,56.76 U2.167
  Bottom Layer w0.254: v1(19.56,56.95) 29.95,56.95 J1.10
P13.0: length 20.4
  Top Layer w0.254: v1(29.84,46.16) 29.92,46.23 29.92,57.08 J1.8 ; U2.156 25.25,45.63 v1(25.4,45.78)
  Bottom Layer w0.254: v1(25.4,45.78) 25.78,46.16 v1(29.84,46.16)
P13.1: length 18.2
  Top Layer w0.254: v1(27.31,46.79) 27.31,55.18 27.37,55.24 27.37,57.09 J1.6 ; v1(25.53,46.79) 24.75,46.02 U2.157
  Bottom Layer w0.254: v1(27.31,46.79) v1(25.53,46.79)
P13.2: length 16.3
  Top Layer w0.254: J1.4 24.83,57.09 24.83,55.24 24.76,55.18 24.76,47.55 24.25,47.04 U2.158
P13.3: length 16.7
  Top Layer w0.254: 23.75,42.7 23.75,45.75 22.35,47.15 22.35,57.03 J1.2
P14.6: length 0.1
  Top Layer w0.254: 29.17,42.78 U2.148
P15.0: length 25
  Top Layer w0.254: J1.5 26.19,49.56 v1(26.29,49.46) ; U2.133 36.75,50.47 v1(36.75,50.47)
  Bottom Layer w0.254: v1(36.75,50.47) 36.4,50.12 36.4,50.11 36.06,49.76 36.04,49.76 35.74,49.46 v1(26.29,49.46)
P15.1: length 19.9
  Top Layer w0.254: J1.7 28.73,50.95 v1(29.34,50.35) ; v1(35.81,50.35) 36.25,49.91 U2.134
  Bottom Layer w0.254: v1(29.34,50.35) v1(35.81,50.35)
P15.2: length 24.9
  Top Layer w0.254: v1(35.43,48.44) 35.75,48.13 U2.135 ; J1.3 v1(23.65,48.57)
  Bottom Layer w0.254: v1(35.43,48.44) 35.31,48.57 v1(23.65,48.57)
P15.3: length 13.6
  Top Layer w0.254: U2.136 35.25,47.48 34.54,48.19 34.54,55 J1.11
P15.4: length 25.8
  Top Layer w0.254: J1.1 21.62,55.22 v1(21.62,48.06) ; U2.137 34.75,46.97 v1(34.42,47.3)
  Bottom Layer w0.254: v1(21.62,48.06) 23.33,48.06 23.41,47.99 23.89,47.99 23.97,48.06 33.66,48.06 v1(34.42,47.3)
P15.5: length 15.8
  Top Layer w0.254: U2.138 34.25,46.2 33.78,46.67 v1(33.78,53.27) ; v1(31.12,53.52) 31.27,53.68 J1.9
  Bottom Layer w0.254: v1(31.12,53.52) 33.53,53.52 v1(33.78,53.27)
P15.6: length 28.7
  Top Layer w0.254: v1(48.77,52.89) 48.88,53 U65.1 ; U2.139 33.75,41.11 v1(33.78,41.08) ; v1(38.61,43.62) 38.61,52.13 v1(38.86,52.38)
  Bottom Layer w0.254: v1(33.78,41.08) 34.04,41.33 36.7,41.33 38.61,43.24 v1(38.61,43.62) ; v1(38.86,52.38) 48.26,52.38 v1(48.77,52.89)
P15.7: length 22.8
  Top Layer w0.254: U2.140 33.25,45.62 v1(33.27,45.65) ; v1(39.5,45.78) 39.5,47.05 43.94,51.49 45.85,51.49 47.62,53.27 U65.2
  Bottom Layer w0.254: v1(39.5,45.78) 33.4,45.78 v1(33.27,45.65)
P20.11: length 22.1
  Top Layer w0.254: U2.129 43.6,39.25 v1(43.69,39.17) ; v1(43.69,37.01) 43.8,36.9 56.71,36.9 U29.6
  Bottom Layer w0.254: v1(43.69,37.01) v1(43.69,39.17)
P20.12: length 21.7
  Top Layer w0.254: U2.130 43.73,39.75 v1(43.94,39.96) ; U29.4 56.57,41.84 v1(44.2,41.84)
  Bottom Layer w0.254: v1(43.94,39.96) 44.2,40.22 v1(44.2,41.84)
P20.13: length 25.3
  Top Layer w0.254: U29.3 56.44,44.25 v1(39.5,44.25) ; U2.131 37.53,40.25 v1(37.34,40.44)
  Bottom Layer w0.254: v1(37.34,40.44) 39.5,42.6 v1(39.5,44.25)
P20.14: length 21.2
  Top Layer w0.254: v1(45.97,39.17) 45.99,39.16 56.43,39.16 U29.5 ; v1(44.96,40.95) 38.9,40.95 U2.132
  Bottom Layer w0.254: v1(44.96,40.95) 45.97,39.93 v1(45.97,39.17)
P21.0: length 19.5
  Top Layer w0.254: U2.105 38.72,27.23 v1(52.96,27.23) ; H6.8 v1(53.09,24.69)
  Bottom Layer w0.254: v1(52.96,27.23) 52.96,24.82 v1(53.09,24.69)
P21.1: length 21.8
  Top Layer w0.254: U2.106 38.78,27.83 53.12,27.83 53.14,27.82 53.2,27.82 53.54,27.48 53.61,27.48 v1(53.97,27.11) ; H6.7 57.16,25.82 55.29,25.82 55.17,25.71 v1(53.97,25.71)
  Bottom Layer w0.254: v1(53.97,25.71) v1(53.97,27.11)
P21.2: length 17.5
  Top Layer w0.254: H6.10 55.12,27.23 54.1,28.25 U2.107
P21.3: length 20.2
  Top Layer w0.254: U2.108 54.11,28.75 54.48,28.38 57.15,28.38 H6.9
P21.4: length 17.3
  Top Layer w0.254: U2.109 55.23,29.25 H6.12
P21.5: length 20.5
  Top Layer w0.254: H6.11 57.16,30.9 55.29,30.9 54.13,29.75 U2.110
P23.0: length 18.8
  Top Layer w0.254: U2.89 41.67,19.25 42.67,20.25 50.8,20.25 53.97,17.07 H6.2
P23.1: length 21.4
  Top Layer w0.254: U2.90 41.67,19.75 42.52,20.61 50.95,20.61 51.8,19.75 51.81,19.75 53.34,18.22 57.15,18.22 H6.1
P23.2: length 17.9
  Top Layer w0.254: U2.91 41.67,20.25 42.38,20.96 54.41,20.96 H6.4
P23.3: length 20.5
  Top Layer w0.254: H6.3 57.16,20.75 55.12,20.75 54.55,21.32 42.23,21.32 41.66,20.75 U2.92
P23.4: length 17.4
  Top Layer w0.254: U2.93 41.66,21.25 42.08,21.67 55.27,21.67 H6.6
P23.5: length 20.7
  Top Layer w0.254: H6.5 57.15,23.3 54.74,23.3 53.47,22.03 41.93,22.03 41.66,21.75 U2.94
P33.5: length 26.5
  Top Layer w0.254: U2.75 30.25,12.4 v1(29.72,11.87) ; v1(15.62,11.74) 15.25,11.37 CN1.5
  Bottom Layer w0.254: v1(15.62,11.74) 29.59,11.74 v1(29.72,11.87)
P33.6: length 25.5
  Top Layer w0.254: v1(29.59,10.85) 30.75,12.01 U2.76 ; v1(16.64,10.72) 16.5,10.59 CN1.6
  Bottom Layer w0.254: v1(29.59,10.85) 29.46,10.72 v1(16.64,10.72)
P33.7: length 25.5
  Top Layer w0.254: v1(17.91,9.96) 17.75,9.81 CN1.7 ; v1(26.79,9.72) 26.79,14.65 v1(26.92,14.79) ; v1(31.37,15.68) 31.25,15.8 U2.77
  Bottom Layer w0.254: v1(26.92,14.79) 30.48,14.79 v1(31.37,15.68) ; v1(17.91,9.96) 26.67,9.96 26.79,9.85 v1(26.79,9.72)
P33.10: length 16.3
  Top Layer w0.254: CN2.5 28.32,5.25 v1(28.32,6.41) ; U2.80 32.75,6.9 v1(32.51,6.66)
  Bottom Layer w0.254: v1(28.32,6.41) 28.57,6.66 v1(32.51,6.66)
P33.12: length 18.7
  Top Layer w0.254: v1(29.97,3.61) 29.5,4.08 CN2.6 ; U2.82 33.75,4.47 v1(33.66,4.37)
  Bottom Layer w0.254: v1(33.66,4.37) 32.89,3.61 v1(29.97,3.61)
P33.13: length 14.9
  Top Layer w0.254: v1(34.42,5.9) 34.25,6.06 U2.83 ; v1(31.88,5.52) 31.12,5.52
  Bottom Layer w0.254: v1(34.42,5.9) 34.04,5.52 v1(31.88,5.52)
POWEREN: length 5.4
  Top Layer w0.254: 53.58,3.79 52.45,4.92 v1(52.45,7.8)
  Bottom Layer w0.254: U44.1 53.06,7.66 52.91,7.8 v1(52.45,7.8)
RST: length 16.4
  Top Layer w0.254: v1(41.28,42.86) 47.37,42.86 H1.10 ; U2.121 38.72,35.23 v1(40.13,35.23)
  Bottom Layer w0.254: v1(41.28,42.86) 41.28,35.61 R6.1 v1(40.13,35.23)
TCK: length 10.9
  Top Layer w0.254: v1(46.1,32.82) 45.85,32.57 41.47,32.57 41.15,32.25 U2.115
  Bottom Layer w0.254: H1.4 46.1,33.97 v1(46.1,32.82)
TDO: length 16.2
  Top Layer w0.254: H1.6 45.47,38.03 v1(45.34,37.9) ; U2.113 45.67,31.25 v1(45.85,31.42)
  Bottom Layer w0.254: v1(45.34,37.9) 45.34,32.12 45.67,31.79 45.67,31.6 v1(45.85,31.42)
TMS: length 11
  Top Layer w0.254: H1.2 47.62,31 47.37,30.75 U2.112
TRST: length 17.7
  Top Layer w0.254: U2.114 43.2,31.75 v1(43.43,31.98) ; v1(44.65,39.43) 44.65,39.88 44.83,40.06 47.12,40.06 H1.8
  Bottom Layer w0.254: v1(44.65,39.43) 44.4,39.43 44.27,39.3 44.27,38.92 44.15,38.8 44.15,37.38 44.27,37.25 44.27,36.77 43.43,35.93 v1(43.43,31.98) 44.28,31.98 R5.1
VAGND1: length 7
  Top Layer w0.254: v1(17.27,18.98) 17.32,18.98 18.25,18.05 U2.51
  Bottom Layer w0.254: v1(17.27,18.98) 17.39,18.98 R3.2 18.2,19.5 18.88,20.18 20.56,20.18 C18.2
VAGND2: length 9.4
  Top Layer w0.254: v1(18.44,29.03) 18.44,28.4 16.76,26.73 v1(14.99,26.73) 14.99,27.11 14.34,27.75 U2.27
  Bottom Layer w0.254: v1(14.99,26.73) 15.11,26.6 R2.1 ; C19.2 18.33,29.03 v1(18.44,29.03)
VAREF1: length 4.4
  Top Layer w0.254: U2.52 18.75,18.81 v1(18.8,18.85)
  Bottom Layer w0.254: C18.1 21.28,19.5 R4.2 18.8,18.86 v1(18.8,18.85)
VAREF2: length 4.6
  Top Layer w0.254: U2.26 15.24,28.25 v1(15.37,28.12)
  Bottom Layer w0.254: C19.1 16.27,29.6 R1.1 16.23,28.12 v1(15.37,28.12)
VGATE1N: length 6.6
  Top Layer w0.254: U2.84 34.75,16.6 34.83,16.52 34.83,16.47 34.85,16.45 v1(34.85,15.3)
  Bottom Layer w0.254: v1(34.85,15.3) 32.13,15.3 31.36,14.53 Q2.2
VGATE1P: length 6.8
  Top Layer w0.254: U2.85 35.25,17.3 35.25,16.36 35.43,16.19 v1(35.43,14.66)
  Bottom Layer w0.254: Q2.3 32.01,14.29 32.38,14.66 v1(35.43,14.66)
$1N2077: length 10.6
  Top Layer w0.254: v1(35.31,22.92) 35.56,23.17 35.56,25.2 36.11,25.75 U2.102
  Bottom Layer w0.254: v1(35.31,22.92) 35.24,22.85 C21.1 32.46,22.99 X1.1
$1N2089: length 7.3
  Top Layer w0.254: v1(35.56,26.34) 37.85,26.34 37.87,26.33 38.62,26.33 U2.103
  Bottom Layer w0.254: v1(35.56,26.34) 33.91,26.34 X1.3 33.44,27.39 C22.2
$1N11467: length 3.4
  Top Layer w0.254: U59.5 50.01,13.91 R83.2 R82.1
$1N11468: length 2.3
  Top Layer w0.254: LED12.2 41.39,16.07 R84.1
$1N18086: length 5.2
  Top Layer w0.254: v1(1.5,27.87) 1.5,28.27 2.41,29.18
  Bottom Layer w0.254: v1(1.5,27.87) R45.1 1.39,26.36 R41.2
$1N18087: length 5.2
  Top Layer w0.254: SW2.1 6.1,28.29 v1(6.1,27.74)
  Bottom Layer w0.254: R46.1 5.86,26.29 R42.2 5.85,27.5 v1(6.1,27.74)
$1N18088: length 5.5
  Top Layer w0.254: SW4.1 7.11,17.71 v1(6.1,16.69)
  Bottom Layer w0.254: v1(6.1,16.69) 6.1,16.68 R44.2 6.06,14.86 R48.1
$1N18089: length 5.5
  Top Layer w0.254: v1(1.52,16.31) 1.52,16.99 SW3.1
  Bottom Layer w0.254: v1(1.52,16.31) 1.41,16.19 R43.2 1.48,14.87 R47.1
$1N21170: length 2.1
  Bottom Layer w0.254: 53.06,5.62 51.65,5.62 C114.2
$1N21171: length 3.9
  Bottom Layer w0.254: R102.2 52.97,4.58 53.72,5.34 53.72,5.6 53.71,5.62
$1N21172: length 3.5
  Bottom Layer w0.254: 54.36,4.26 54.36,4.04 R104.2 ; 54.36,4.26 R103.2 ; 54.36,4.26 54.36,5.62
$1N21174: length 1.4
  Top Layer w0.254: R105.1 56.51,11.87 LED13.2
$1N22434: length 3.8
  Top Layer w0.254: R106.2 50.58,3.97 50.58,3.79
$1N22519: length 25.8
  Top Layer w0.254: v1(42.93,46.16) 49.53,46.16 51.45,48.08 51.45,49.62 51.56,49.73 U42.1
  Bottom Layer w0.254: C20.2 40.82,33.32 R13.1 42.41,33.44 R6.2 42.93,35.75 v1(42.93,46.16)

## Copper pours and planes (outline as drawn; the poured copper is in the pictures)
+5V on Top Layer: 46.99,14.28 48.48,14.28 48.55,14.35 48.55,11.28 47.32,11.28 46.99,11.61
+5V on Bottom Layer: 54.74,8.31 54.74,7.55 54.86,7.42 55.08,7.42 55.08,6.09 54.81,6.09 54.74,6.03 54.74,5.22 55.65,5.22 55.95,4.93 55.95,3.16 56.13,2.98 57.66,2.98 57.78,3.1 57.78,6.89 56.13,6.89 55.75,7.04 55.75,8.44 54.86,8.44
GND on Top Layer: -0.51,60.64 60.32,60.64 60.32,-1.34 -0.51,-1.34
GND on Bottom Layer: -0.51,60.51 60.45,60.51 60.45,-1.09 -0.51,-1.09
VCC1V25 on Bottom Layer: 28.98,8.13 32.71,8.13 32.89,8.31 32.89,7.42 32.64,7.17 30.23,7.17 30.1,7.04 28.96,7.04 28.83,7.17 28.83,7.98
VCC3V3 on Top Layer: 42.96,19.45 48.61,19.45 48.77,19.61 48.77,18.14 43.36,18.14 43.18,17.96 42.96,18.19
VCC3V3 on Bottom Layer: 32.51,14.28 35.25,14.28 35.51,14.02 35.51,12.88 35.25,12.63 33.02,12.63 32.38,13.26 32.38,14.15
VIN on Bottom Layer: 41.66,14.92 45.59,14.92 45.59,11.1 54.48,11.1 54.48,8.63 54.17,8.63 54.1,8.56 54.1,7.41 53.48,7.41 53.21,7.68 53.21,8.44 50.8,8.44 50.16,9.07 41.91,9.07 41.15,9.84 41.15,14.41
$1N1853 on Bottom Layer: 30.25,12.75 33.27,12.75 33.27,8.95 30.46,8.95 30.25,9.18
$1N11464 on Top Layer: 43.05,17.07 48.39,17.07 48.39,15.68 48.26,15.55 42.59,15.55 42.59,16.61

## Text on the board
Top Silkscreen Layer: VCC | GND | 5V | VGRT2 | VGRT3 | 屏幕 | 摄像头 | GCBACBA1 | ADC | PWM | GCBACBA2 | 21.4 21.5 / 21.2 21.3 / 21.0 21.1 / 23.4 23.5 / 23.2 23.3 / 23.0 23.1 | 关 | 开 | 陀螺仪
